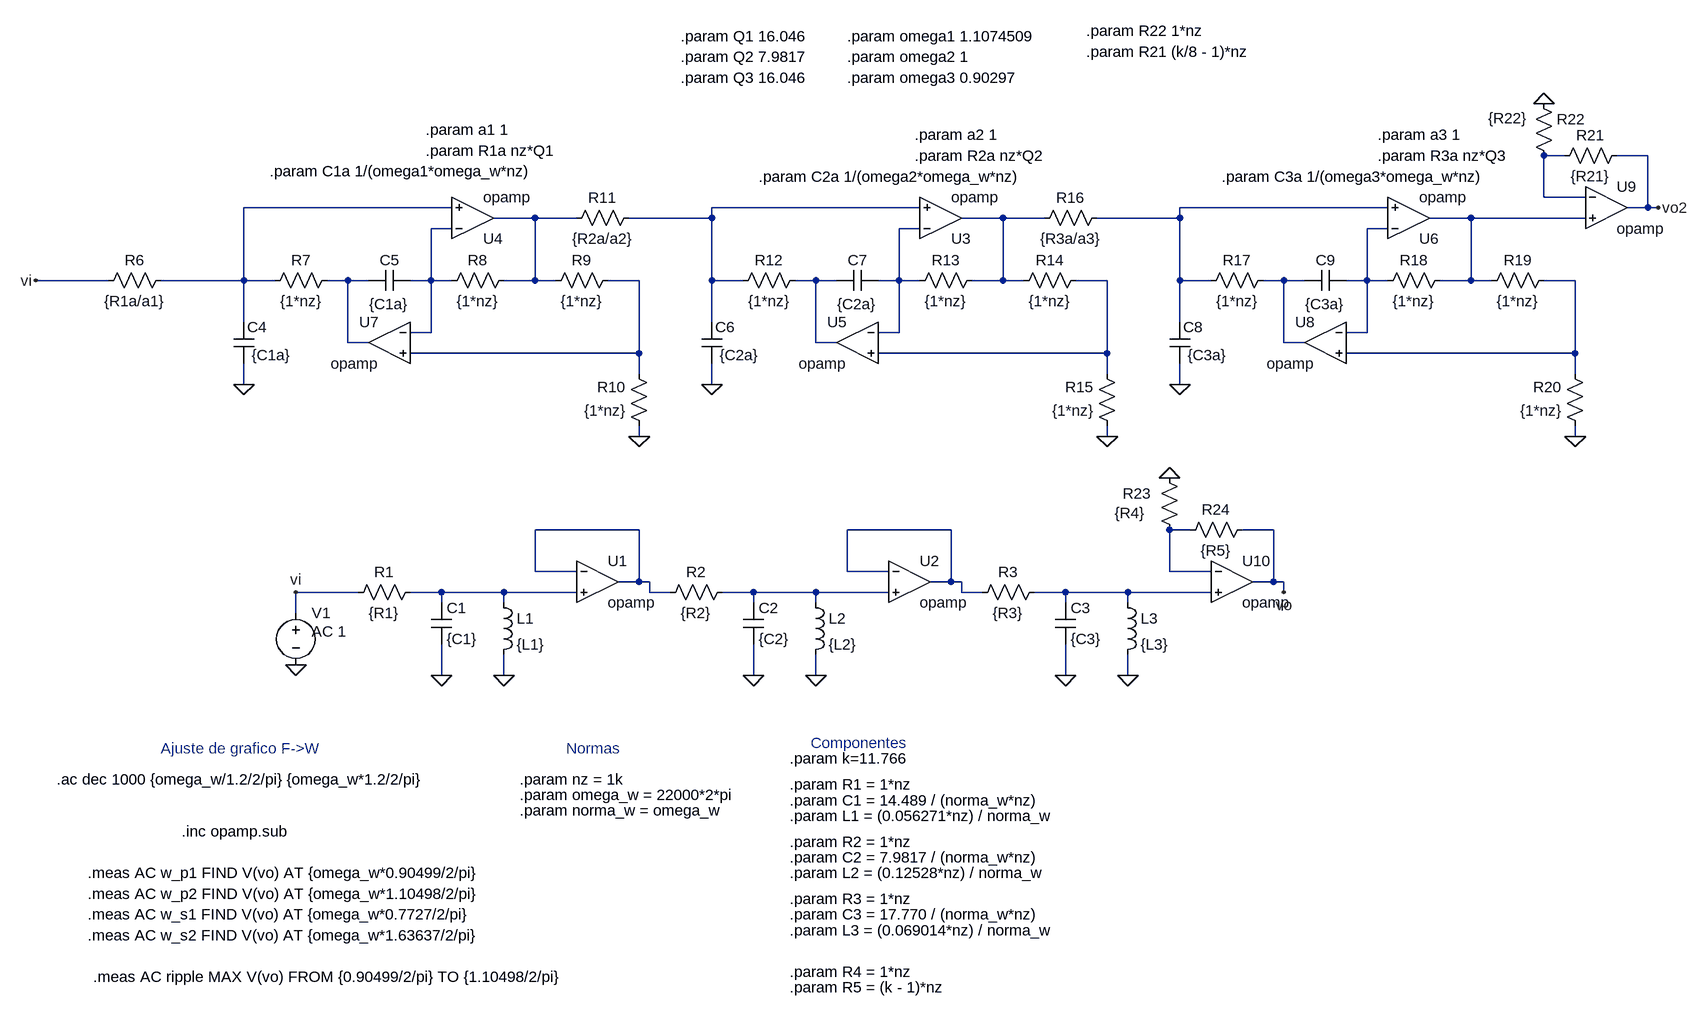
[diagram p0: schematic simulacion-activado.asc]
simulacion-activado.asc, the LTspice schematic file:
Version 4
SHEET 1 3052 832
WIRE 1744 -464 1712 -464
WIRE 1872 -464 1824 -464
WIRE 1712 -400 1712 -464
WIRE 1776 -400 1712 -400
WIRE 32 -384 -288 -384
WIRE 752 -384 432 -384
WIRE 1472 -384 1152 -384
WIRE 1872 -384 1872 -464
WIRE 1872 -384 1840 -384
WIRE 1888 -384 1872 -384
WIRE 160 -368 96 -368
WIRE 224 -368 160 -368
WIRE 432 -368 432 -384
WIRE 432 -368 304 -368
WIRE 880 -368 816 -368
WIRE 944 -368 880 -368
WIRE 1152 -368 1152 -384
WIRE 1152 -368 1024 -368
WIRE 1600 -368 1536 -368
WIRE 1776 -368 1600 -368
WIRE 32 -352 0 -352
WIRE 752 -352 720 -352
WIRE 1472 -352 1440 -352
WIRE -496 -272 -608 -272
WIRE -288 -272 -288 -384
WIRE -288 -272 -416 -272
WIRE -240 -272 -288 -272
WIRE -128 -272 -160 -272
WIRE -96 -272 -128 -272
WIRE 0 -272 0 -352
WIRE 0 -272 -32 -272
WIRE 32 -272 0 -272
WIRE 160 -272 160 -368
WIRE 160 -272 112 -272
WIRE 192 -272 160 -272
WIRE 320 -272 272 -272
WIRE 432 -272 432 -368
WIRE 480 -272 432 -272
WIRE 592 -272 560 -272
WIRE 624 -272 592 -272
WIRE 720 -272 720 -352
WIRE 720 -272 688 -272
WIRE 752 -272 720 -272
WIRE 880 -272 880 -368
WIRE 880 -272 832 -272
WIRE 912 -272 880 -272
WIRE 1040 -272 992 -272
WIRE 1152 -272 1152 -368
WIRE 1200 -272 1152 -272
WIRE 1312 -272 1280 -272
WIRE 1344 -272 1312 -272
WIRE 1440 -272 1440 -352
WIRE 1440 -272 1408 -272
WIRE 1472 -272 1440 -272
WIRE 1600 -272 1600 -368
WIRE 1600 -272 1552 -272
WIRE 1632 -272 1600 -272
WIRE 1760 -272 1712 -272
WIRE -288 -208 -288 -272
WIRE 432 -208 432 -272
WIRE 1152 -208 1152 -272
WIRE 0 -192 0 -272
WIRE 0 -192 -32 -192
WIRE 720 -192 720 -272
WIRE 720 -192 688 -192
WIRE 1440 -192 1440 -272
WIRE 1440 -192 1408 -192
WIRE -128 -176 -128 -272
WIRE -96 -176 -128 -176
WIRE 592 -176 592 -272
WIRE 624 -176 592 -176
WIRE 1312 -176 1312 -272
WIRE 1344 -176 1312 -176
WIRE 320 -160 320 -272
WIRE 320 -160 -32 -160
WIRE 1040 -160 1040 -272
WIRE 1040 -160 688 -160
WIRE 1760 -160 1760 -272
WIRE 1760 -160 1408 -160
WIRE 320 -128 320 -160
WIRE 1040 -128 1040 -160
WIRE 1760 -128 1760 -160
WIRE -288 -112 -288 -144
WIRE 432 -112 432 -144
WIRE 1152 -112 1152 -144
WIRE 320 -32 320 -48
WIRE 1040 -32 1040 -48
WIRE 1760 -32 1760 -48
WIRE 320 112 160 112
WIRE 800 112 640 112
WIRE 1168 112 1136 112
WIRE 1296 112 1248 112
WIRE 160 176 160 112
WIRE 224 176 160 176
WIRE 640 176 640 112
WIRE 704 176 640 176
WIRE 1136 176 1136 112
WIRE 1200 176 1136 176
WIRE 320 192 320 112
WIRE 320 192 288 192
WIRE 336 192 320 192
WIRE 800 192 800 112
WIRE 800 192 768 192
WIRE 816 192 800 192
WIRE 1296 192 1296 112
WIRE 1296 192 1264 192
WIRE 1312 192 1296 192
WIRE -112 208 -208 208
WIRE 16 208 -32 208
WIRE 112 208 16 208
WIRE 224 208 112 208
WIRE 336 208 336 192
WIRE 368 208 336 208
WIRE 496 208 448 208
WIRE 592 208 496 208
WIRE 704 208 592 208
WIRE 816 208 816 192
WIRE 848 208 816 208
WIRE 976 208 928 208
WIRE 1072 208 976 208
WIRE 1200 208 1072 208
WIRE 1312 208 1312 192
WIRE 16 224 16 208
WIRE 112 224 112 208
WIRE 496 224 496 208
WIRE 592 224 592 208
WIRE 976 224 976 208
WIRE 1072 224 1072 208
WIRE -208 240 -208 208
WIRE 16 336 16 288
WIRE 112 336 112 304
WIRE 496 336 496 288
WIRE 592 336 592 304
WIRE 976 336 976 288
WIRE 1072 336 1072 304
FLAG 16 336 0
FLAG 112 336 0
FLAG -208 320 0
FLAG 496 336 0
FLAG 592 336 0
FLAG 976 336 0
FLAG 1072 336 0
FLAG 1312 208 vo
FLAG -208 208 vi
FLAG -608 -272 vi
FLAG 320 -32 0
FLAG -288 -112 0
FLAG 1040 -32 0
FLAG 1760 -32 0
FLAG 1712 -544 0
FLAG 432 -112 0
FLAG 1152 -112 0
FLAG 1136 32 0
FLAG 1888 -384 vo2
SYMBOL res -16 192 R90
WINDOW 0 0 56 VBottom 2
WINDOW 3 32 56 VTop 2
SYMATTR InstName R1
SYMATTR Value {R1}
SYMBOL cap 0 224 R0
SYMATTR InstName C1
SYMATTR Value {C1}
SYMBOL ind 96 208 R0
SYMATTR InstName L1
SYMATTR Value {L1}
SYMBOL voltage -208 224 R0
WINDOW 123 24 44 Left 2
WINDOW 39 0 0 Left 0
SYMATTR Value2 AC 1
SYMATTR InstName V1
SYMATTR Value ""
SYMBOL OpAmps\\opamp 256 128 R0
SYMATTR InstName U1
SYMBOL res 464 192 R90
WINDOW 0 0 56 VBottom 2
WINDOW 3 32 56 VTop 2
SYMATTR InstName R2
SYMATTR Value {R2}
SYMBOL cap 480 224 R0
SYMATTR InstName C2
SYMATTR Value {C2}
SYMBOL ind 576 208 R0
SYMATTR InstName L2
SYMATTR Value {L2}
SYMBOL OpAmps\\opamp 736 128 R0
SYMATTR InstName U2
SYMBOL res 944 192 R90
WINDOW 0 0 56 VBottom 2
WINDOW 3 32 56 VTop 2
SYMATTR InstName R3
SYMATTR Value {R3}
SYMBOL cap 960 224 R0
SYMATTR InstName C3
SYMATTR Value {C3}
SYMBOL ind 1056 208 R0
SYMATTR InstName L3
SYMATTR Value {L3}
SYMBOL OpAmps\\opamp 64 -304 M180
SYMATTR InstName U4
SYMATTR SpiceLine2 GBW=10G
SYMBOL OpAmps\\opamp -64 -240 M0
SYMATTR InstName U7
SYMATTR SpiceLine2 GBW=10G
SYMBOL cap -32 -288 R90
WINDOW 0 0 32 VBottom 2
WINDOW 3 37 33 VTop 2
SYMATTR InstName C5
SYMATTR Value {C1a}
SYMBOL res -144 -288 R90
WINDOW 0 0 56 VBottom 2
WINDOW 3 32 56 VTop 2
SYMATTR InstName R7
SYMATTR Value {1*nz}
SYMBOL res -400 -288 R90
WINDOW 0 0 56 VBottom 2
WINDOW 3 32 56 VTop 2
SYMATTR InstName R6
SYMATTR Value {R1a/a1}
SYMBOL res 128 -288 R90
WINDOW 0 0 56 VBottom 2
WINDOW 3 32 56 VTop 2
SYMATTR InstName R8
SYMATTR Value {1*nz}
SYMBOL res 288 -288 R90
WINDOW 0 0 56 VBottom 2
WINDOW 3 32 56 VTop 2
SYMATTR InstName R9
SYMATTR Value {1*nz}
SYMBOL res 336 -32 R180
WINDOW 0 36 76 Left 2
WINDOW 3 36 40 Left 2
SYMATTR InstName R10
SYMATTR Value {1*nz}
SYMBOL cap -272 -144 R180
WINDOW 0 -20 56 Left 2
WINDOW 3 -57 13 Left 2
SYMATTR InstName C4
SYMATTR Value {C1a}
SYMBOL OpAmps\\opamp 784 -304 M180
SYMATTR InstName U3
SYMATTR SpiceLine2 GBW=10G
SYMBOL OpAmps\\opamp 656 -240 M0
SYMATTR InstName U5
SYMATTR SpiceLine2 GBW=10G
SYMBOL cap 688 -288 R90
WINDOW 0 0 32 VBottom 2
WINDOW 3 37 33 VTop 2
SYMATTR InstName C7
SYMATTR Value {C2a}
SYMBOL res 576 -288 R90
WINDOW 0 0 56 VBottom 2
WINDOW 3 32 56 VTop 2
SYMATTR InstName R12
SYMATTR Value {1*nz}
SYMBOL res 320 -384 R90
WINDOW 0 0 56 VBottom 2
WINDOW 3 32 56 VTop 2
SYMATTR InstName R11
SYMATTR Value {R2a/a2}
SYMBOL res 848 -288 R90
WINDOW 0 0 56 VBottom 2
WINDOW 3 32 56 VTop 2
SYMATTR InstName R13
SYMATTR Value {1*nz}
SYMBOL res 1008 -288 R90
WINDOW 0 0 56 VBottom 2
WINDOW 3 32 56 VTop 2
SYMATTR InstName R14
SYMATTR Value {1*nz}
SYMBOL res 1056 -32 R180
WINDOW 0 36 76 Left 2
WINDOW 3 36 40 Left 2
SYMATTR InstName R15
SYMATTR Value {1*nz}
SYMBOL cap 448 -144 R180
WINDOW 0 -20 56 Left 2
WINDOW 3 -57 13 Left 2
SYMATTR InstName C6
SYMATTR Value {C2a}
SYMBOL OpAmps\\opamp 1504 -304 M180
SYMATTR InstName U6
SYMATTR SpiceLine2 GBW=10G
SYMBOL OpAmps\\opamp 1376 -240 M0
SYMATTR InstName U8
SYMATTR SpiceLine2 GBW=10G
SYMBOL cap 1408 -288 R90
WINDOW 0 0 32 VBottom 2
WINDOW 3 37 33 VTop 2
SYMATTR InstName C9
SYMATTR Value {C3a}
SYMBOL res 1296 -288 R90
WINDOW 0 0 56 VBottom 2
WINDOW 3 32 56 VTop 2
SYMATTR InstName R17
SYMATTR Value {1*nz}
SYMBOL res 1040 -384 R90
WINDOW 0 0 56 VBottom 2
WINDOW 3 32 56 VTop 2
SYMATTR InstName R16
SYMATTR Value {R3a/a3}
SYMBOL res 1568 -288 R90
WINDOW 0 0 56 VBottom 2
WINDOW 3 32 56 VTop 2
SYMATTR InstName R18
SYMATTR Value {1*nz}
SYMBOL res 1728 -288 R90
WINDOW 0 0 56 VBottom 2
WINDOW 3 32 56 VTop 2
SYMATTR InstName R19
SYMATTR Value {1*nz}
SYMBOL res 1776 -32 R180
WINDOW 0 36 76 Left 2
WINDOW 3 36 40 Left 2
SYMATTR InstName R20
SYMATTR Value {1*nz}
SYMBOL cap 1168 -144 R180
WINDOW 0 -20 56 Left 2
WINDOW 3 -57 13 Left 2
SYMATTR InstName C8
SYMATTR Value {C3a}
SYMBOL OpAmps\\opamp 1808 -448 R0
SYMATTR InstName U9
SYMATTR SpiceLine2 GBW=10G
SYMBOL res 1696 -560 R0
WINDOW 3 -70 38 Left 2
SYMATTR InstName R22
SYMATTR Value {R22}
SYMBOL res 1840 -480 R90
WINDOW 0 0 56 VBottom 2
WINDOW 3 32 56 VTop 2
SYMATTR InstName R21
SYMATTR Value {R21}
SYMBOL OpAmps\\opamp 1232 128 R0
SYMATTR InstName U10
SYMBOL res 1120 16 R0
WINDOW 0 -56 40 Left 2
WINDOW 3 -68 70 Left 2
SYMATTR InstName R23
SYMATTR Value {R4}
SYMBOL res 1264 96 R90
WINDOW 0 0 56 VBottom 2
WINDOW 3 32 56 VTop 2
SYMATTR InstName R24
SYMATTR Value {R5}
TEXT -576 496 Left 2 !.ac dec 1000 {omega_w/1.2/2/pi} {omega_w*1.2/2/pi}
TEXT -416 448 Left 2 ;Ajuste de grafico F->W
TEXT -384 576 Left 2 !.inc opamp.sub
TEXT 208 448 Left 2 ;Normas
TEXT 136 520 Left 2 !.param omega_w = 22000*2*pi
TEXT 136 544 Left 2 !.param norma_w = omega_w
TEXT 136 496 Left 2 !.param nz = 1k
TEXT 584 440 Left 2 ;Componentes
TEXT 552 504 Left 2 !.param R1 = 1*nz
TEXT 552 528 Left 2 !.param C1 = 14.489 / (norma_w*nz)
TEXT 552 552 Left 2 !.param L1 = (0.056271*nz) / norma_w
TEXT 552 592 Left 2 !.param R2 = 1*nz
TEXT 552 616 Left 2 !.param C2 = 7.9817 / (norma_w*nz)
TEXT 552 640 Left 2 !.param L2 = (0.12528*nz) / norma_w
TEXT 552 680 Left 2 !.param R3 = 1*nz
TEXT 552 704 Left 2 !.param C3 = 17.770 / (norma_w*nz)
TEXT 552 728 Left 2 !.param L3 = (0.069014*nz) / norma_w
TEXT 384 -648 Left 2 !.param Q1 16.046
TEXT 384 -616 Left 2 !.param Q2 7.9817
TEXT 384 -584 Left 2 !.param Q3 16.046
TEXT -8 -504 Left 2 !.param a1 1
TEXT -8 -472 Left 2 !.param R1a nz*Q1
TEXT 640 -648 Left 2 !.param omega1 1.1074509
TEXT 640 -616 Left 2 !.param omega2 1
TEXT 640 -584 Left 2 !.param omega3 0.90297
TEXT -248 -440 Left 2 !.param C1a 1/(omega1*omega_w*nz)
TEXT 744 -496 Left 2 !.param a2 1
TEXT 744 -464 Left 2 !.param R2a nz*Q2
TEXT 504 -432 Left 2 !.param C2a 1/(omega2*omega_w*nz)
TEXT 1456 -496 Left 2 !.param a3 1
TEXT 1456 -464 Left 2 !.param R3a nz*Q3
TEXT 1216 -432 Left 2 !.param C3a 1/(omega3*omega_w*nz)
TEXT 552 464 Left 2 !.param k=11.766
TEXT 552 792 Left 2 !.param R4 = 1*nz
TEXT 552 816 Left 2 !.param R5 = (k - 1)*nz
TEXT -528 640 Left 2 !.meas AC w_p1 FIND V(vo) AT {omega_w*0.90499/2/pi}
TEXT -528 672 Left 2 !.meas AC w_p2 FIND V(vo) AT {omega_w*1.10498/2/pi}
TEXT -528 704 Left 2 !.meas AC w_s1 FIND V(vo) AT {omega_w*0.7727/2/pi}
TEXT -528 736 Left 2 !.meas AC w_s2 FIND V(vo) AT {omega_w*1.63637/2/pi}
TEXT -520 800 Left 2 !.meas AC ripple MAX V(vo) FROM {0.90499/2/pi} TO {1.10498/2/pi}
TEXT 1008 -656 Left 2 !.param R22 1*nz
TEXT 1008 -624 Left 2 !.param R21 (k/8 - 1)*nz

The netlist it stands for:
* simulacion-activado.asc
R1 N020 vi {R1}
C1 N020 0 {C1}
L1 N020 0 {L1}
V1 vi 0 AC 1
XU1 N017 N020 N017 opamp Aol=100K GBW=10Meg  ; pins invin noninvin out
R2 N021 N017 {R2}
C2 N021 0 {C2}
L2 N021 0 {L2}
XU2 N018 N021 N018 opamp Aol=100K GBW=10Meg  ; pins invin noninvin out
R3 N022 N018 {R3}
C3 N022 0 {C3}
L3 N022 0 {L3}
XU4 N008 N002 N005 opamp Aol=100K GBW=10G  ; pins invin noninvin out
XU7 N008 N012 N011 opamp Aol=100K GBW=10G  ; pins invin noninvin out
C5 N008 N011 {C1a}
R7 N011 N002 {1*nz}
R6 N002 vi {R1a/a1}
R8 N005 N008 {1*nz}
R9 N012 N005 {1*nz}
R10 0 N012 {1*nz}
C4 0 N002 {C1a}
XU3 N009 N003 N006 opamp Aol=100K GBW=10G  ; pins invin noninvin out
XU5 N009 N014 N013 opamp Aol=100K GBW=10G  ; pins invin noninvin out
C7 N009 N013 {C2a}
R12 N013 N003 {1*nz}
R11 N003 N005 {R2a/a2}
R13 N006 N009 {1*nz}
R14 N014 N006 {1*nz}
R15 0 N014 {1*nz}
C6 0 N003 {C2a}
XU6 N010 N004 N007 opamp Aol=100K GBW=10G  ; pins invin noninvin out
XU8 N010 N016 N015 opamp Aol=100K GBW=10G  ; pins invin noninvin out
C9 N010 N015 {C3a}
R17 N015 N004 {1*nz}
R16 N004 N006 {R3a/a3}
R18 N007 N010 {1*nz}
R19 N016 N007 {1*nz}
R20 0 N016 {1*nz}
C8 0 N004 {C3a}
XU9 N001 N007 vo2 opamp Aol=100K GBW=10G  ; pins invin noninvin out
R22 0 N001 {R22}
R21 vo2 N001 {R21}
XU10 N019 N022 vo opamp Aol=100K GBW=10Meg  ; pins invin noninvin out
R23 0 N019 {R4}
R24 vo N019 {R5}
.ac dec 1000 {omega_w/1.2/2/pi} {omega_w*1.2/2/pi}
* Ajuste de grafico F->W
.inc opamp.sub
* Normas
.param omega_w = 22000*2*pi
.param norma_w = omega_w
.param nz = 1k
* Componentes
.param R1 = 1*nz
.param C1 = 14.489 / (norma_w*nz)
.param L1 = (0.056271*nz) / norma_w
.param R2 = 1*nz
.param C2 = 7.9817 / (norma_w*nz)
.param L2 = (0.12528*nz) / norma_w
.param R3 = 1*nz
.param C3 = 17.770 / (norma_w*nz)
.param L3 = (0.069014*nz) / norma_w
.param Q1 16.046
.param Q2 7.9817
.param Q3 16.046
.param a1 1
.param R1a nz*Q1
.param omega1 1.1074509
.param omega2 1
.param omega3 0.90297
.param C1a 1/(omega1*omega_w*nz)
.param a2 1
.param R2a nz*Q2
.param C2a 1/(omega2*omega_w*nz)
.param a3 1
.param R3a nz*Q3
.param C3a 1/(omega3*omega_w*nz)
.param k=11.766
.param R4 = 1*nz
.param R5 = (k - 1)*nz
.meas AC w_p1 FIND V(vo) AT {omega_w*0.90499/2/pi}
.meas AC w_p2 FIND V(vo) AT {omega_w*1.10498/2/pi}
.meas AC w_s1 FIND V(vo) AT {omega_w*0.7727/2/pi}
.meas AC w_s2 FIND V(vo) AT {omega_w*1.63637/2/pi}
.meas AC ripple MAX V(vo) FROM {0.90499/2/pi} TO {1.10498/2/pi}
.param R22 1*nz
.param R21 (k/8 - 1)*nz
.backanno
.end

* Results of the author's LTspice run, read from the files saved beside the schematic
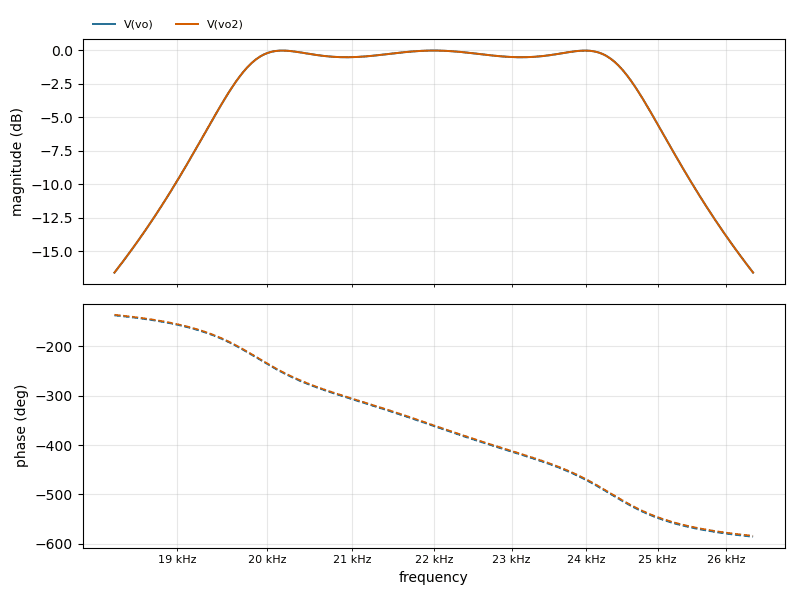
[diagram p1: AC Analysis of simulacion-activado.asc, plotted from the saved traces]
* AC Analysis, 1 run:
*   V(vo): -16.61 dB at 18.33 kHz, -16.60 dB at 26.4 kHz, peak -0.01 dB at 21.99 kHz, 3 dB below the peak at 19.58 kHz and 24.72 kHz
*   V(vo2): -16.60 dB at 18.33 kHz, -16.61 dB at 26.4 kHz, peak -0.00 dB at 21.99 kHz, 3 dB below the peak at 19.58 kHz and 24.72 kHz
* From the log:
*   w_p1: v(vo)=(-0.516116dB,133.597°) at 19909.8
*   w_p2: v(vo)=(-0.517574dB,-136.941°) at 24309.6
*   w_s1: v(vo)=(-20.1656dB,-5.19566°) at 16999.4
*   w_s2: v(vo)=(-0.260204dB,-24.7774°) at 36000.1
*   ripple: MAX(v(vo))=(9.43949dB,22.7237°) FROM 0.144034 TO 0.175863